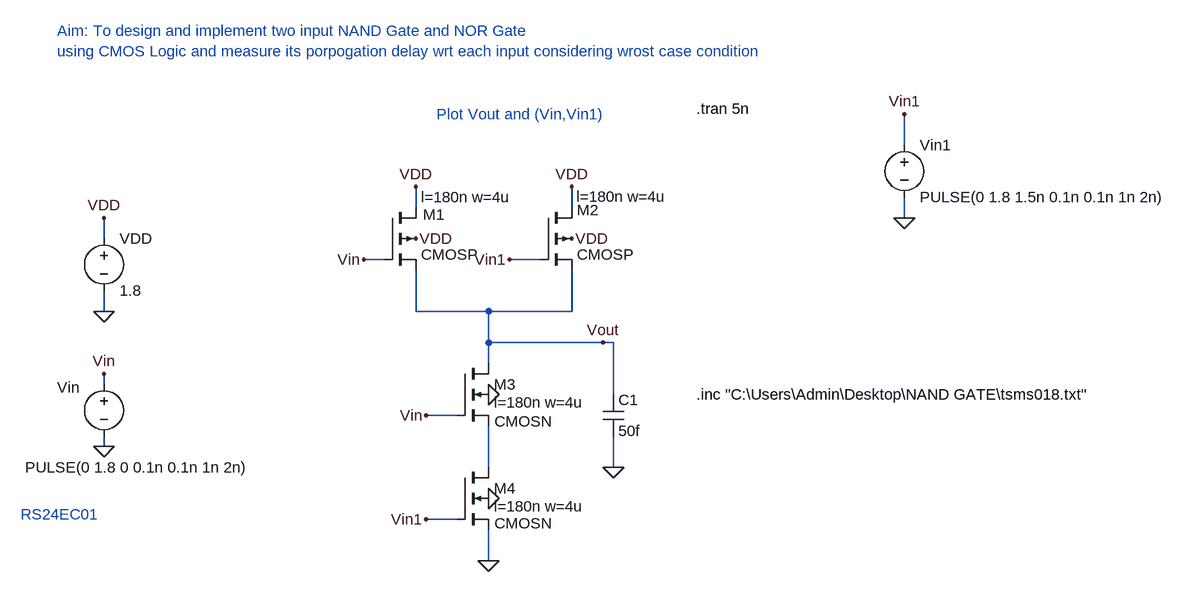
[diagram p0: schematic CMOS_NAND_GATE_Truth table.asc]
CMOS_NAND_GATE_Truth table.asc, the LTspice schematic file:
Version 4
SHEET 1 3764 680
WIRE 1984 -576 1984 -624
WIRE 1232 -480 1232 -512
WIRE 1472 -480 1472 -512
WIRE 1984 -464 1984 -496
WIRE 752 -432 752 -464
WIRE 1184 -400 1152 -400
WIRE 1424 -400 1376 -400
WIRE 752 -320 752 -352
WIRE 1232 -320 1232 -384
WIRE 1344 -320 1232 -320
WIRE 1472 -320 1472 -384
WIRE 1472 -320 1344 -320
WIRE 1344 -272 1344 -320
WIRE 1520 -272 1344 -272
WIRE 1536 -272 1520 -272
WIRE 1344 -240 1344 -272
WIRE 752 -208 752 -224
WIRE 1536 -192 1536 -272
WIRE 1296 -160 1248 -160
WIRE 752 -112 752 -128
WIRE 1344 -80 1344 -144
WIRE 1536 -80 1536 -128
WIRE 1296 0 1248 0
WIRE 1344 64 1344 16
FLAG 752 -112 0
FLAG 752 -224 Vin
FLAG 752 -320 0
FLAG 752 -464 VDD
FLAG 1520 -272 Vout
FLAG 1232 -512 VDD
FLAG 1472 -512 VDD
FLAG 1232 -432 VDD
FLAG 1472 -432 VDD
FLAG 1344 -192 0
FLAG 1344 -32 0
FLAG 1152 -400 Vin
FLAG 1376 -400 Vin1
FLAG 1248 -160 Vin
FLAG 1248 0 Vin1
FLAG 1536 -80 0
FLAG 1344 64 0
FLAG 1984 -624 Vin1
FLAG 1984 -464 0
SYMBOL voltage 752 -224 R0
WINDOW 0 -72 21 Left 2
WINDOW 3 -121 144 Left 2
WINDOW 123 0 0 Left 2
WINDOW 39 0 0 Left 2
SYMATTR InstName Vin
SYMATTR Value PULSE(0 1.8 0 0.1n 0.1n 1n 2n)
SYMBOL voltage 752 -448 R0
WINDOW 123 0 0 Left 2
WINDOW 39 0 0 Left 2
SYMATTR InstName VDD
SYMATTR Value 1.8
SYMBOL pmos4 1184 -480 R0
WINDOW 0 59 11 Left 2
WINDOW 123 56 -16 Left 2
SYMATTR InstName M1
SYMATTR Value2 l=180n w=4u
SYMATTR Value CMOSP
SYMBOL pmos4 1424 -480 R0
WINDOW 0 56 4 Left 2
WINDOW 123 55 -17 Left 2
SYMATTR InstName M2
SYMATTR Value2 l=180n w=4u
SYMATTR Value CMOSP
SYMBOL nmos4 1296 -240 R0
WINDOW 3 57 89 Left 2
WINDOW 123 56 60 Left 2
SYMATTR Value CMOSN
SYMATTR Value2 l=180n w=4u
SYMATTR InstName M3
SYMBOL nmos4 1296 -80 R0
WINDOW 3 57 86 Left 2
WINDOW 123 56 60 Left 2
SYMATTR Value CMOSN
SYMATTR Value2 l=180n w=4u
SYMATTR InstName M4
SYMBOL cap 1520 -192 R0
SYMATTR InstName C1
SYMATTR Value 50f
SYMBOL voltage 1984 -592 R0
WINDOW 123 0 0 Left 0
WINDOW 39 0 0 Left 0
SYMATTR InstName Vin1
SYMATTR Value PULSE(0 1.8 1.5n 0.1n 0.1n 1n 2n)
TEXT 1664 -632 Left 2 !.tran 5n
TEXT 1664 -192 Left 2 !.inc "C:\\Users\\Admin\\Desktop\\NAND GATE\\tsms018.txt"
TEXT 1264 -624 Left 2 ;Plot Vout and (Vin,Vin1)
TEXT 680 -752 Left 2 ;Aim: To design and implement two input NAND Gate and NOR Gate \nusing CMOS Logic and measure its porpogation delay wrt each input considering wrost case condition
TEXT 624 -8 Left 2 ;RS24EC01

The netlist it stands for:
* CMOS_NAND_GATE_Truth table.asc
Vin Vin 0 PULSE(0 1.8 0 0.1n 0.1n 1n 2n)
VDD VDD 0 1.8
M1 VDD Vin Vout VDD CMOSP l=180n w=4u
M2 VDD Vin1 Vout VDD CMOSP l=180n w=4u
M3 Vout Vin N001 0 CMOSN l=180n w=4u
M4 N001 Vin1 0 0 CMOSN l=180n w=4u
C1 Vout 0 50f
Vin1 Vin1 0 PULSE(0 1.8 1.5n 0.1n 0.1n 1n 2n)
.model NMOS NMOS
.model PMOS PMOS
.lib standard.mos
.tran 5n
.inc "C:\Users\Admin\Desktop\NAND GATE\tsms018.txt"
* Plot Vout and (Vin,Vin1)
* Aim: To design and implement two input NAND Gate and NOR Gate
* using CMOS Logic and measure its porpogation delay wrt each input considering wrost case condition
* RS24EC01
.backanno
.end

* Results of the author's LTspice run, read from the files saved beside the schematic
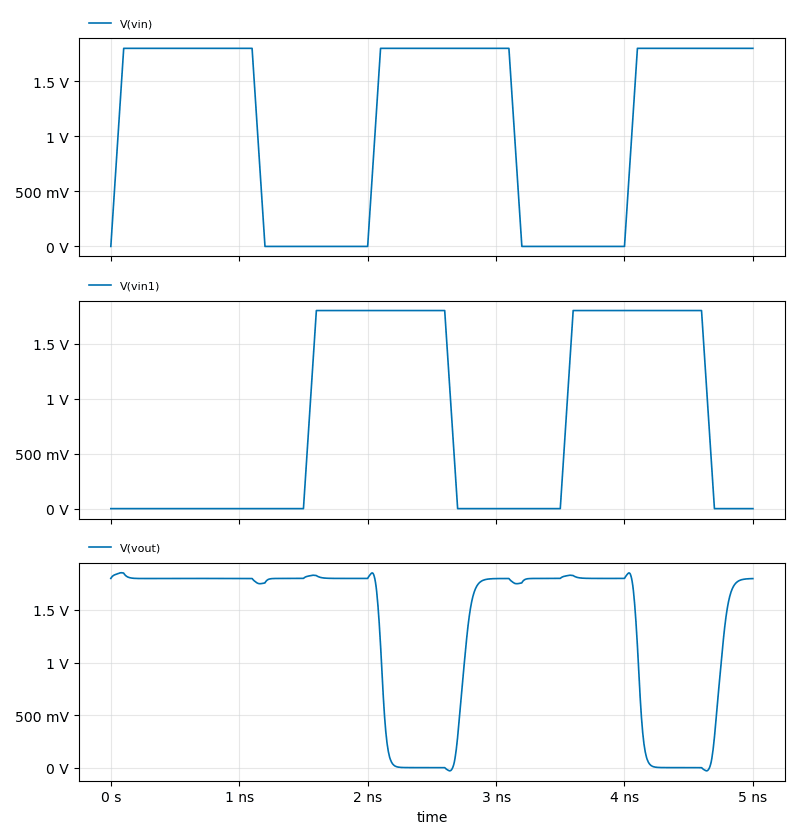
[diagram p1: Transient Analysis of CMOS_NAND_GATE_Truth table.asc, plotted from the saved traces]
* Transient Analysis, 1 run:
*   V(vin): min 0 V, max 1.8 V, average 1.134 V, rms 1.41 V, last 1.8 V
*   V(vin1): min 0 V, max 1.8 V, average 792 mV, rms 1.176 V, last 0 V
*   V(vout): min -30.48 mV, max 1.854 V, average 1.343 V, rms 1.536 V, last 1.799 V